# Altium schematic sheet PCB_LED_CALENDAR__SINGLE_MONTH_31D.SchDoc
size A3; Author: Andrzej Laczewski; DrawnBy: Andrzej Laczewski; SheetNumber: 3; SheetTotal: 4
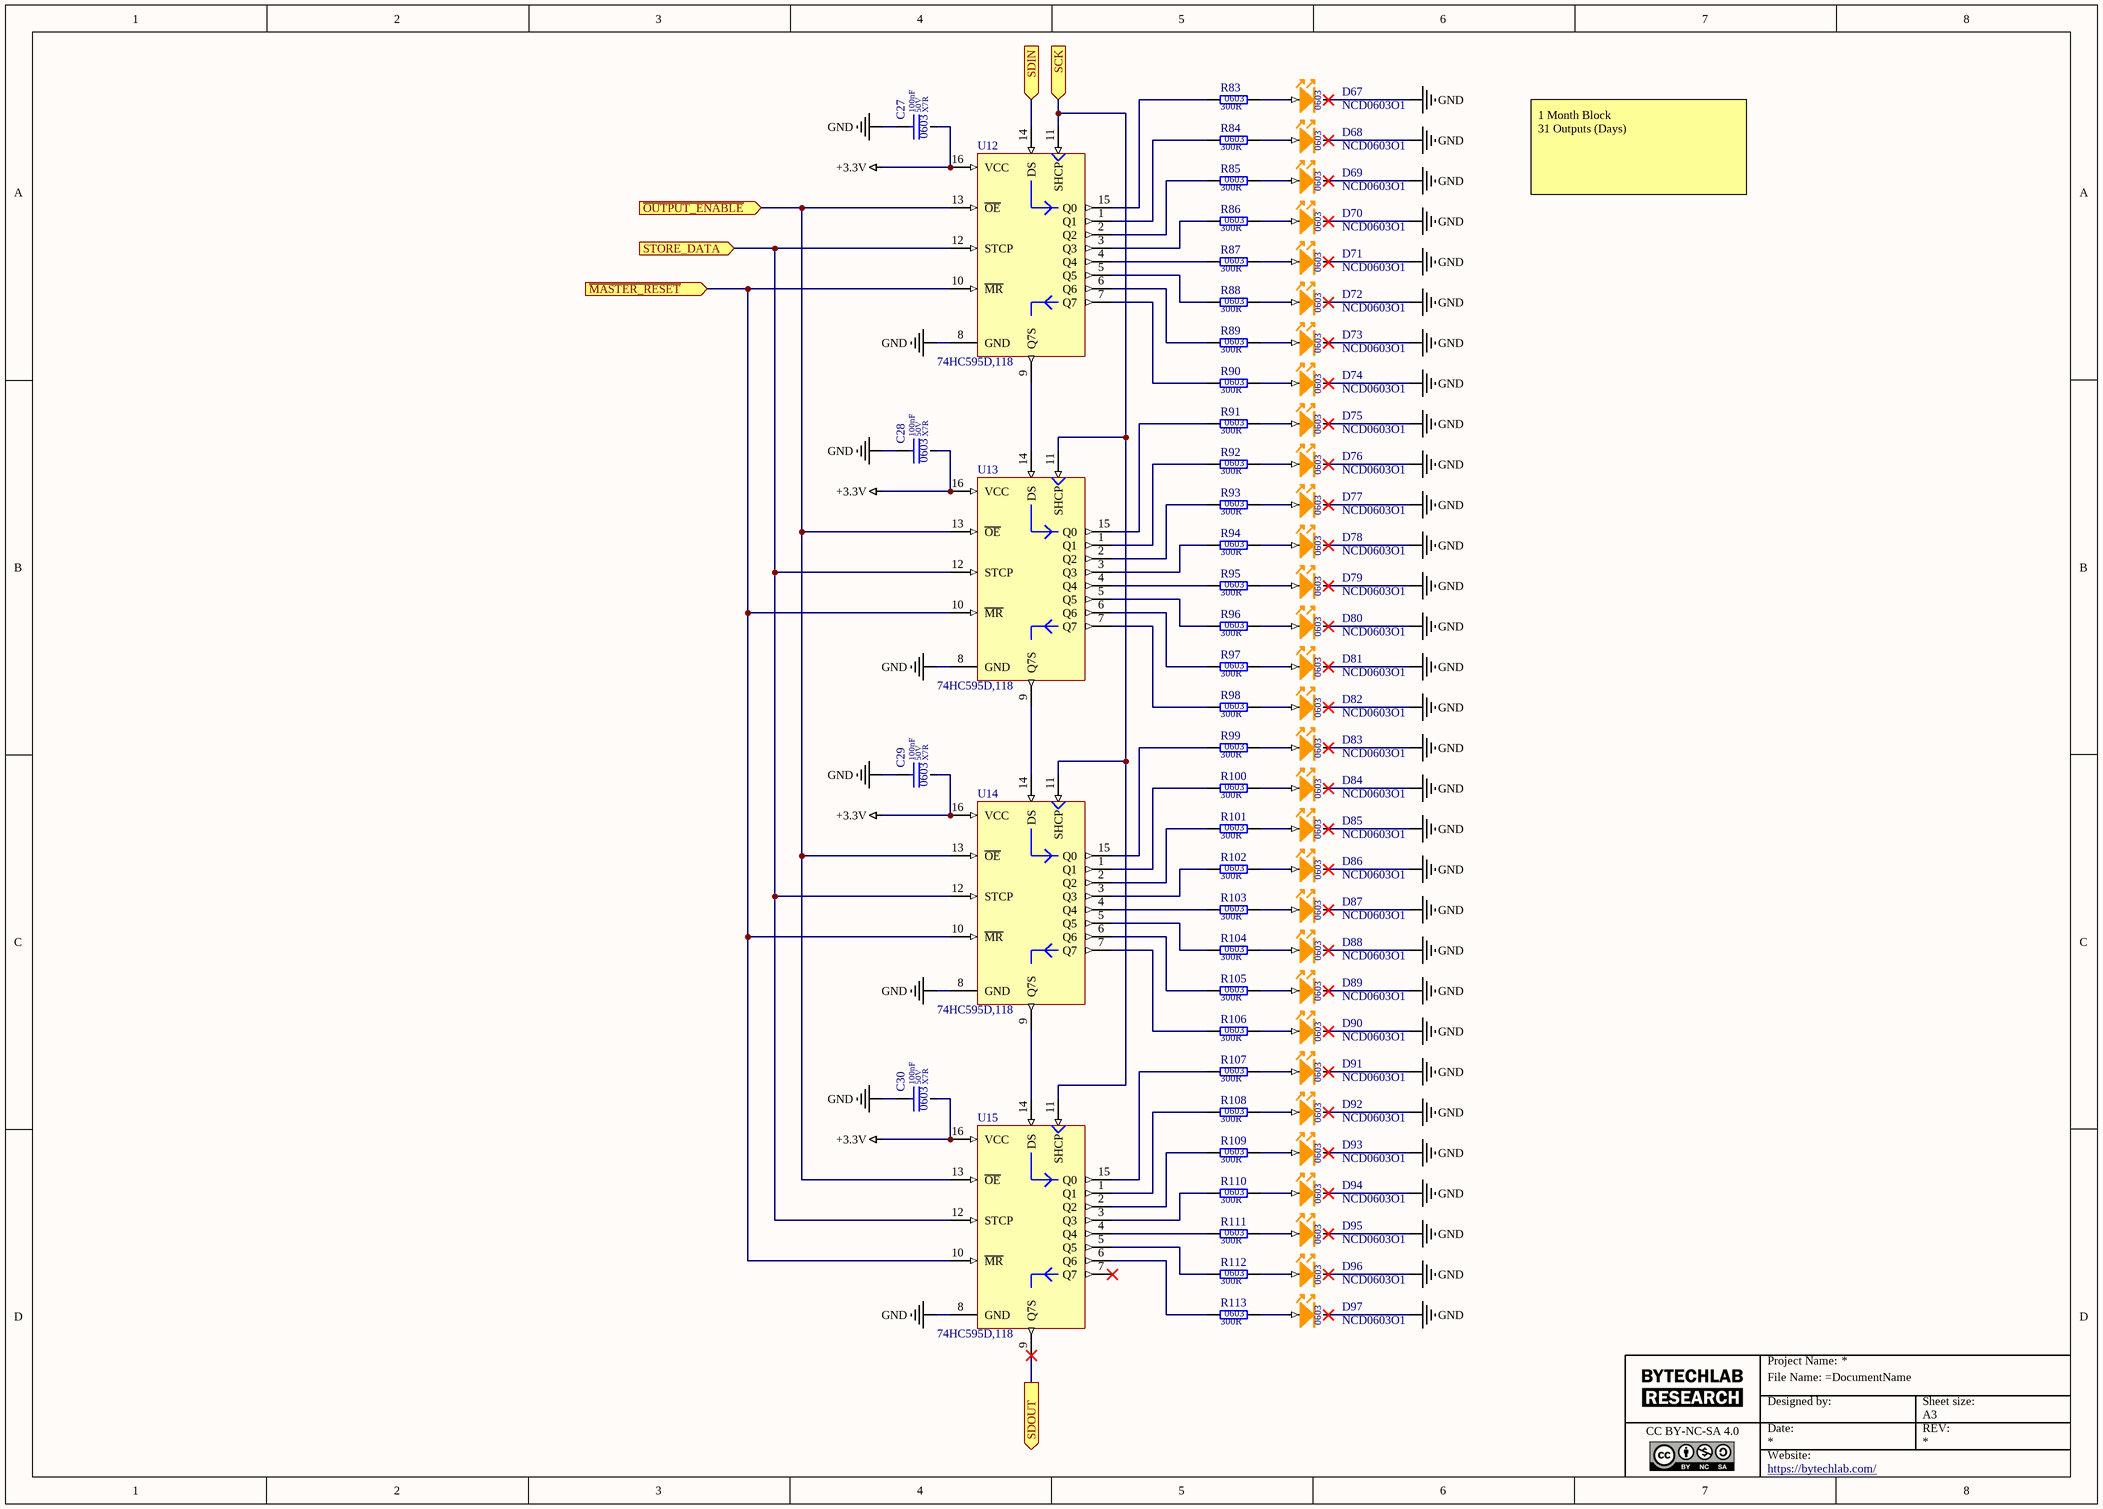
[diagram p0: PCB_LED_CALENDAR__SINGLE_MONTH_31D.SchDoc]

## Parts
C27  value 100nF  Dielectric: X7R  Voltage: 50V  SCH_Footprint: 0603  [C_0603_1608]  (hidden comment: Ceramic X7R)
C28  value 100nF  Dielectric: X7R  Voltage: 50V  SCH_Footprint: 0603  [C_0603_1608]  (hidden comment: Ceramic X7R)
C29  value 100nF  Dielectric: X7R  Voltage: 50V  SCH_Footprint: 0603  [C_0603_1608]  (hidden comment: Ceramic X7R)
C30  value 100nF  Dielectric: X7R  Voltage: 50V  SCH_Footprint: 0603  [C_0603_1608]  (hidden comment: Ceramic X7R)
D67  NCD0603O1  SCH_Footprint: 0603  [LED_0603]
D68  NCD0603O1  SCH_Footprint: 0603  [LED_0603]
D69  NCD0603O1  SCH_Footprint: 0603  [LED_0603]
D70  NCD0603O1  SCH_Footprint: 0603  [LED_0603]
D71  NCD0603O1  SCH_Footprint: 0603  [LED_0603]
D72  NCD0603O1  SCH_Footprint: 0603  [LED_0603]
D73  NCD0603O1  SCH_Footprint: 0603  [LED_0603]
D74  NCD0603O1  SCH_Footprint: 0603  [LED_0603]
D75  NCD0603O1  SCH_Footprint: 0603  [LED_0603]
D76  NCD0603O1  SCH_Footprint: 0603  [LED_0603]
D77  NCD0603O1  SCH_Footprint: 0603  [LED_0603]
D78  NCD0603O1  SCH_Footprint: 0603  [LED_0603]
D79  NCD0603O1  SCH_Footprint: 0603  [LED_0603]
D80  NCD0603O1  SCH_Footprint: 0603  [LED_0603]
D81  NCD0603O1  SCH_Footprint: 0603  [LED_0603]
D82  NCD0603O1  SCH_Footprint: 0603  [LED_0603]
D83  NCD0603O1  SCH_Footprint: 0603  [LED_0603]
D84  NCD0603O1  SCH_Footprint: 0603  [LED_0603]
D85  NCD0603O1  SCH_Footprint: 0603  [LED_0603]
D86  NCD0603O1  SCH_Footprint: 0603  [LED_0603]
D87  NCD0603O1  SCH_Footprint: 0603  [LED_0603]
D88  NCD0603O1  SCH_Footprint: 0603  [LED_0603]
D89  NCD0603O1  SCH_Footprint: 0603  [LED_0603]
D90  NCD0603O1  SCH_Footprint: 0603  [LED_0603]
D91  NCD0603O1  SCH_Footprint: 0603  [LED_0603]
D92  NCD0603O1  SCH_Footprint: 0603  [LED_0603]
D93  NCD0603O1  SCH_Footprint: 0603  [LED_0603]
D94  NCD0603O1  SCH_Footprint: 0603  [LED_0603]
D95  NCD0603O1  SCH_Footprint: 0603  [LED_0603]
D96  NCD0603O1  SCH_Footprint: 0603  [LED_0603]
D97  NCD0603O1  SCH_Footprint: 0603  [LED_0603]
R83  value 300R  SCH_Footprint: 0603  [R_0603_1608]  (hidden comment: Resistor)
R84  value 300R  SCH_Footprint: 0603  [R_0603_1608]  (hidden comment: Resistor)
R85  value 300R  SCH_Footprint: 0603  [R_0603_1608]  (hidden comment: Resistor)
R86  value 300R  SCH_Footprint: 0603  [R_0603_1608]  (hidden comment: Resistor)
R87  value 300R  SCH_Footprint: 0603  [R_0603_1608]  (hidden comment: Resistor)
R88  value 300R  SCH_Footprint: 0603  [R_0603_1608]  (hidden comment: Resistor)
R89  value 300R  SCH_Footprint: 0603  [R_0603_1608]  (hidden comment: Resistor)
R90  value 300R  SCH_Footprint: 0603  [R_0603_1608]  (hidden comment: Resistor)
R91  value 300R  SCH_Footprint: 0603  [R_0603_1608]  (hidden comment: Resistor)
R92  value 300R  SCH_Footprint: 0603  [R_0603_1608]  (hidden comment: Resistor)
R93  value 300R  SCH_Footprint: 0603  [R_0603_1608]  (hidden comment: Resistor)
R94  value 300R  SCH_Footprint: 0603  [R_0603_1608]  (hidden comment: Resistor)
R95  value 300R  SCH_Footprint: 0603  [R_0603_1608]  (hidden comment: Resistor)
R96  value 300R  SCH_Footprint: 0603  [R_0603_1608]  (hidden comment: Resistor)
R97  value 300R  SCH_Footprint: 0603  [R_0603_1608]  (hidden comment: Resistor)
R98  value 300R  SCH_Footprint: 0603  [R_0603_1608]  (hidden comment: Resistor)
R99  value 300R  SCH_Footprint: 0603  [R_0603_1608]  (hidden comment: Resistor)
R100  value 300R  SCH_Footprint: 0603  [R_0603_1608]  (hidden comment: Resistor)
R101  value 300R  SCH_Footprint: 0603  [R_0603_1608]  (hidden comment: Resistor)
R102  value 300R  SCH_Footprint: 0603  [R_0603_1608]  (hidden comment: Resistor)
R103  value 300R  SCH_Footprint: 0603  [R_0603_1608]  (hidden comment: Resistor)
R104  value 300R  SCH_Footprint: 0603  [R_0603_1608]  (hidden comment: Resistor)
R105  value 300R  SCH_Footprint: 0603  [R_0603_1608]  (hidden comment: Resistor)
R106  value 300R  SCH_Footprint: 0603  [R_0603_1608]  (hidden comment: Resistor)
R107  value 300R  SCH_Footprint: 0603  [R_0603_1608]  (hidden comment: Resistor)
R108  value 300R  SCH_Footprint: 0603  [R_0603_1608]  (hidden comment: Resistor)
R109  value 300R  SCH_Footprint: 0603  [R_0603_1608]  (hidden comment: Resistor)
R110  value 300R  SCH_Footprint: 0603  [R_0603_1608]  (hidden comment: Resistor)
R111  value 300R  SCH_Footprint: 0603  [R_0603_1608]  (hidden comment: Resistor)
R112  value 300R  SCH_Footprint: 0603  [R_0603_1608]  (hidden comment: Resistor)
R113  value 300R  SCH_Footprint: 0603  [R_0603_1608]  (hidden comment: Resistor)
U12  74HC595D,118  [SO16]
U13  74HC595D,118  [SO16]
U14  74HC595D,118  [SO16]
U15  74HC595D,118  [SO16]

## Ports
SCK (in), SDIN (in), SDOUT (out), STORE_DATA (in), ~{MASTER_RESET} (in), ~{OUTPUT_ENABLE} (in)

## Nets
+3.3V: C27.2 C28.2 C29.2 C30.2 U12.16(VCC) U13.16(VCC) U14.16(VCC) U15.16(VCC)
GND: C27.1 C28.1 C29.1 C30.1 D67.1(K) D68.1(K) D69.1(K) D70.1(K) D71.1(K) D72.1(K) D73.1(K) D74.1(K) D75.1(K) D76.1(K) D77.1(K) D78.1(K) D79.1(K) D80.1(K) D81.1(K) D82.1(K) D83.1(K) D84.1(K) D85.1(K) D86.1(K) D87.1(K) D88.1(K) D89.1(K) D90.1(K) D91.1(K) D92.1(K) D93.1(K) D94.1(K) D95.1(K) D96.1(K) D97.1(K) U12.8(GND) U13.8(GND) U14.8(GND) U15.8(GND)
~{MASTER_RESET}: U12.10(~{MR}) U13.10(~{MR}) U14.10(~{MR}) U15.10(~{MR}) ; port ~{MASTER_RESET}
~{OUTPUT_ENABLE}: U12.13(~{OE}) U13.13(~{OE}) U14.13(~{OE}) U15.13(~{OE}) ; port ~{OUTPUT_ENABLE}
SCK: U12.11(SHCP) U13.11(SHCP) U14.11(SHCP) U15.11(SHCP) ; port SCK
SDIN: U12.14(DS) ; port SDIN
SDOUT: U15.9(Q7S) ; port SDOUT
STORE_DATA: U12.12(STCP) U13.12(STCP) U14.12(STCP) U15.12(STCP) ; port STORE_DATA
NetD67_2: D67.2(A) R83.2
NetD68_2: D68.2(A) R84.2
NetD69_2: D69.2(A) R85.2
NetD70_2: D70.2(A) R86.2
NetD71_2: D71.2(A) R87.2
NetD72_2: D72.2(A) R88.2
NetD73_2: D73.2(A) R89.2
NetD74_2: D74.2(A) R90.2
NetD75_2: D75.2(A) R91.2
NetD76_2: D76.2(A) R92.2
NetD77_2: D77.2(A) R93.2
NetD78_2: D78.2(A) R94.2
NetD79_2: D79.2(A) R95.2
NetD80_2: D80.2(A) R96.2
NetD81_2: D81.2(A) R97.2
NetD82_2: D82.2(A) R98.2
NetD83_2: D83.2(A) R99.2
NetD84_2: D84.2(A) R100.2
NetD85_2: D85.2(A) R101.2
NetD86_2: D86.2(A) R102.2
NetD87_2: D87.2(A) R103.2
NetD88_2: D88.2(A) R104.2
NetD89_2: D89.2(A) R105.2
NetD90_2: D90.2(A) R106.2
NetD91_2: D91.2(A) R107.2
NetD92_2: D92.2(A) R108.2
NetD93_2: D93.2(A) R109.2
NetD94_2: D94.2(A) R110.2
NetD95_2: D95.2(A) R111.2
NetD96_2: D96.2(A) R112.2
NetD97_2: D97.2(A) R113.2
NetR83_1: R83.1 U12.15(Q0)
NetR84_1: R84.1 U12.1(Q1)
NetR85_1: R85.1 U12.2(Q2)
NetR86_1: R86.1 U12.3(Q3)
NetR87_1: R87.1 U12.4(Q4)
NetR88_1: R88.1 U12.5(Q5)
NetR89_1: R89.1 U12.6(Q6)
NetR90_1: R90.1 U12.7(Q7)
NetR91_1: R91.1 U13.15(Q0)
NetR92_1: R92.1 U13.1(Q1)
NetR93_1: R93.1 U13.2(Q2)
NetR94_1: R94.1 U13.3(Q3)
NetR95_1: R95.1 U13.4(Q4)
NetR96_1: R96.1 U13.5(Q5)
NetR97_1: R97.1 U13.6(Q6)
NetR98_1: R98.1 U13.7(Q7)
NetR99_1: R99.1 U14.15(Q0)
NetR100_1: R100.1 U14.1(Q1)
NetR101_1: R101.1 U14.2(Q2)
NetR102_1: R102.1 U14.3(Q3)
NetR103_1: R103.1 U14.4(Q4)
NetR104_1: R104.1 U14.5(Q5)
NetR105_1: R105.1 U14.6(Q6)
NetR106_1: R106.1 U14.7(Q7)
NetR107_1: R107.1 U15.15(Q0)
NetR108_1: R108.1 U15.1(Q1)
NetR109_1: R109.1 U15.2(Q2)
NetR110_1: R110.1 U15.3(Q3)
NetR111_1: R111.1 U15.4(Q4)
NetR112_1: R112.1 U15.5(Q5)
NetR113_1: R113.1 U15.6(Q6)
NetU12_9: U12.9(Q7S) U13.14(DS)
NetU13_9: U13.9(Q7S) U14.14(DS)
NetU14_9: U14.9(Q7S) U15.14(DS)

Not connected (* = marked no-connect by the designer): U15 7(Q7)*

## Notes on the sheet
- 1 Month Block
  31 Outputs (Days)
- Project Name:
- File Name: =DocumentName
- CC BY-NC-SA 4.0
- Designed by:
- Date:
- Website:
- Sheet size:
- A3
- REV:
- https://bytechlab.com/
- Title:
- from project
- Sheet:
- of
- Revision
- Author:
- File name:
- Checked by:
- Size:
- A2
- Approved by:

## Library data of the parts
C27-C30 = C_100nF_50V_X7R_0603_5: Capacitor; Manufacturer: Samsung; Manufacturer Part Number: CL10B104JB8NNNC; Tolerance (%): 5; Part Number: C_100nF_50V_X7R_0603_5; HelpURL: http://www.tme.eu/pl/Document/4a42202b32dab16128fe107dd69598cc/samsung-chip-cap.pdf; Supplier 1: TME; Supplier Part Number 1: CL10B104JB8NNNC; Supplier 2: RS Components; Supplier Part Number 2: 7665455; Supplier 3: Farnell; Supplier 4: Mouser; Supplier 5: Digi-Key; Supplier Part Number 5: 1276-1033-1-ND; Supplier 6: LCSC; Supplier Part Number 6: C24452
D67-D97 = OL_NCD0603O1: Orange 130° 65mW 1.6V~2.6V 0603; Manufacturer: Foshan NationStar Optoelectronics; Manufacturer Part Number: NCD0603O1; Supplier 1: JLCPCB; Supplier Part Number 1: C84269
R83-R113 = R_300R_0603_1: Manufacturer: Yageo; Manufacturer Part Number: RC0603FR-07300RL; Voltage: 50V; Power: 100mW; Tolerance: 1%; Part Number: R_300R_0603_1; HelpURL: https://www.tme.eu/Document/d2a72e545e5c8eb7bf2a04fa97535928/rc0603yageo.pdf; Supplier 1: TME; Supplier Part Number 1: RC0603FR-07300R; Supplier 2: RS Components; Supplier 3: Farnell; Supplier Part Number 3: 2413696; Supplier 4: Mouser; Supplier Part Number 4: 603-RC0603FR-07300RL; Supplier 5: Digi-Key; Supplier Part Number 5: 311-300HRCT-ND; Supplier 6: LCSC
U12-U15 = U_74HC595D,118: 8-bit serial-in, serial or parallel-out shift register with output latches; 3-state; Manufacturer: Nexperia; Manufacturer Part Number: 74HC595D,118; Supplier 1: JLCPCB; Supplier Part Number 1: C5947